# EAGLE schematic EMC03-Motion Control (EAGLE 7.4.0)

## Sheet 1 of 3: MCU
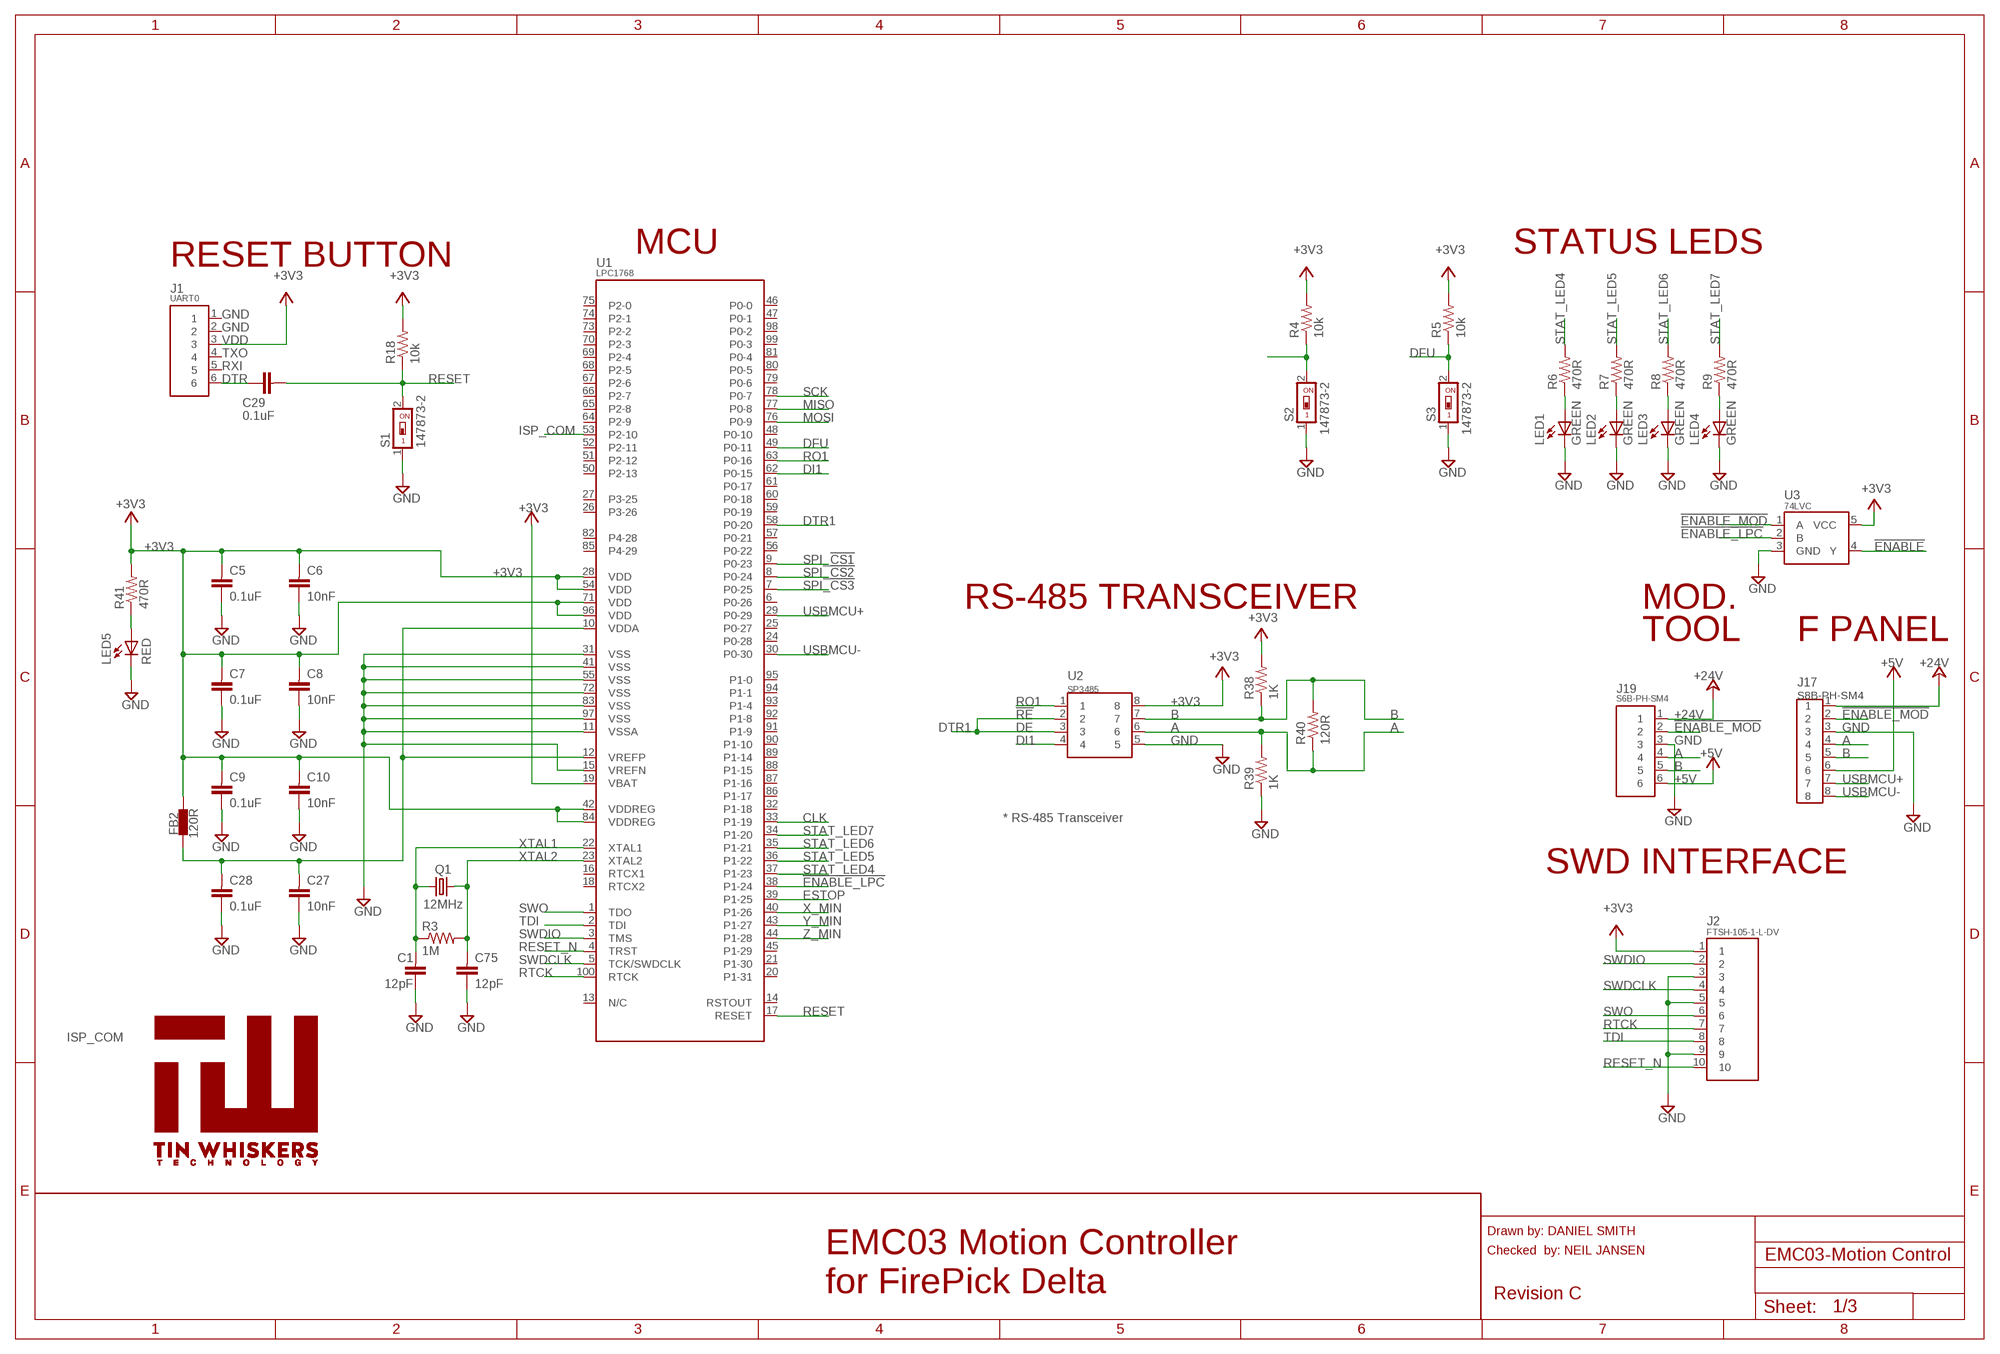
[diagram p0: schematic, sheet 1]

### Parts
C1  12pF  CPL-CAP-C0G-0603-12PF-50V  [C0603]
C5  0.1uF  CPL-CAP-X5R-0603-0.1UF-35V  [C0603]
C6  10nF  CPL-CAP-X7R-10NF-16V  [C0603]
C7  0.1uF  CPL-CAP-X5R-0603-0.1UF-35V  [C0603]
C8  10nF  CPL-CAP-X7R-10NF-16V  [C0603]
C9  0.1uF  CPL-CAP-X5R-0603-0.1UF-35V  [C0603]
C10  10nF  CPL-CAP-X7R-10NF-16V  [C0603]
C27  10nF  CPL-CAP-X7R-10NF-16V  [C0603]
C28  0.1uF  CPL-CAP-X5R-0603-0.1UF-35V  [C0603]
C29  0.1uF  CPL-CAP-X7R-0603-0.1UF-35V  [C0603]
C75  12pF  CPL-CAP-C0G-0603-12PF-50V  [C0603]
FB2  120R  CPL-IND-FER-120OHM-2A  [F0603]
J1  UART0  CPL-CON-HEADER-0.1IN-6P-M  [CON-HDR-6POS-MALE]
J2  FTSH-105-1-L-DV  CPL-CON-HEADER-0.05IN-10P-M  [FTSH-105-01-XXX-DV-K]
J17  S8B-PH-SM4  CPL-CON-JST-2.0MM-8P-M-RA  [CONN-JST-PH-2.0MM-8P-SMT-RA]
J19  S6B-PH-SM4  CPL-CON-JST-2.0MM-6P-M-RA  [CONN-JST-PH-2.0MM-6P-SMT-RA]
LED1  GREEN  CPL-LED-0603-GREEN  [LED0603]
LED2  GREEN  CPL-LED-0603-GREEN  [LED0603]
LED3  GREEN  CPL-LED-0603-GREEN  [LED0603]
LED4  GREEN  CPL-LED-0603-GREEN  [LED0603]
LED5  RED  CPL-LED-0603-RED  [LED0603]
Q1  12MHz  CPL-OSC-CRY-12MHZ-18PF  [HC-49/U-S]
R3  1M  CPL-RES-0603-1M-0.1W  [R0603]
R4  10k  CPL-RES-0603-10K-0.1W  [R0603]
R5  10k  CPL-RES-0603-10K-0.1W  [R0603]
R6  470R  CPL-RES-0603-470R-0.1W  [R0603]
R7  470R  CPL-RES-0603-470R-0.1W  [R0603]
R8  470R  CPL-RES-0603-470R-0.1W  [R0603]
R9  470R  CPL-RES-0603-470R-0.1W  [R0603]
R18  10k  CPL-RES-0603-10K-0.1W  [R0603]
R38  1K  CPL-RES-0603-1K-0.1W  [R0603]
R39  1K  CPL-RES-0603-1K-0.1W  [R0603]
R40  120R  CPL-RES-0603-120-0.1W  [R0603]
R41  470R  CPL-RES-0603-470R-0.1W  [R0603]
S1  147873-2  CPL-SW-MOM-147873-2  [147873-2]
S2  147873-2  CPL-SW-MOM-147873-2  [147873-2]
S3  147873-2  CPL-SW-MOM-147873-2  [147873-2]
U1  LPC1768  LPC1768LQFP-100  [100-LQFP]
U2  SP3485  [SOICN-8]
U3  74LVC  CPL-IC-LOGIC-OR-1CH-74LVC  [SOT-23-5]
U$1  TIN-WHISKERSSMALL  [TIN-WHISKERS-SMALL]

### Nets
!ENABLE: U3.4(Y) ; also sheet 2,3
!ENABLE_LPC: U1.38(P1-24) U3.2(B)
!ENABLE_MOD: J17.2 J19.2 U3.1(A)
+3V3: C5.2 C6.2 C7.2 C8.2 C9.2 C10.2 FB2.2 J1.3 J2.1 R4.2 R5.2 R18.2 R38.2 R41.2 U1.19(VBAT) U1.28(VDD) U1.42(VDDREG) U1.54(VDD) U1.71(VDD) U1.84(VDDREG) U1.96(VDD) U2.8 U3.5(VCC) ; also sheet 2
+5V [power]: J17.6 J19.6 ; also sheet 2
+24V: J17.1 J19.1 ; also sheet 2,3
A: J17.4 J19.4 R39.2 R40.1 U2.6
B: J17.5 J19.5 R38.1 R40.2 U2.7
CLK: U1.33(P1-19) ; also sheet 2,3
DFU: R5.1 S3.2 U1.49(P0-11)
DI1: U1.62(P0-15) U2.4
DPWR: C27.2 C28.2 FB2.1 U1.10(VDDA) U1.12(VREFP)
DTR: C29.1 J1.6
DTR1: U1.58(P0-20) U2.2 U2.3
ESTOP: U1.39(P1-25)
GND [power]: C1.1 C5.1 C6.1 C7.1 C8.1 C9.1 C10.1 C27.1 C28.1 C75.1 J2.3 J2.5 J2.9 J17.3 J19.3 LED1.C LED2.C LED3.C LED4.C LED5.C R39.1 S1.1 S2.1 S3.1 U1.11(VSSA) U1.15(VREFN) U1.31(VSS) U1.41(VSS) U1.55(VSS) U1.72(VSS) U1.83(VSS) U1.97(VSS) U2.5 U3.3(GND) ; also sheet 2,3
ISP_COM: R4.1 S2.2 U1.53(P2-10)
MISO: U1.77(P0-8) ; also sheet 2,3
MOSI: U1.76(P0-9) ; also sheet 2,3
N$9: LED5.A R41.1
N$20: LED1.A R6.1
N$24: LED2.A R7.1
N$25: LED4.A R9.1
N$26: LED3.A R8.1
RESET: C29.2 R18.1 S1.2 U1.17(RESET)
RESET_N: J2.10 U1.4(TRST)
RO1: U1.63(P0-16) U2.1
RTCK: J2.7 U1.100(RTCK)
SCK: U1.78(P0-7) ; also sheet 2,3
SPI_!CS1: U1.9(P0-23) ; also sheet 2
SPI_!CS2: U1.8(P0-24) ; also sheet 3
SPI_!CS3: U1.7(P0-25) ; also sheet 3
STAT_LED4: R6.2 U1.37(P1-23)
STAT_LED5: R7.2 U1.36(P1-22)
STAT_LED6: R8.2 U1.35(P1-21)
STAT_LED7: R9.2 U1.34(P1-20)
SWDCLK: J2.4 U1.5(TCK/SWDCLK)
SWDIO: J2.2 U1.3(TMS)
SWO: J2.6 U1.1(TDO)
TDI: J2.8 U1.2(TDI)
USBMCU+: J17.7 U1.29(P0-29)
USBMCU-: J17.8 U1.30(P0-30)
X_MIN: U1.40(P1-26) ; also sheet 2
XTAL1: C1.2 Q1.1 R3.1 U1.22(XTAL1)
XTAL2: C75.2 Q1.2 R3.2 U1.23(XTAL2)
Y_MIN: U1.43(P1-27) ; also sheet 2
Z_MIN: U1.44(P1-28) ; also sheet 2
Unconnected: J1.1 J1.2 J1.4 J1.5 U1.6(P0-26) U1.13(N/C) U1.14(RSTOUT) U1.16(RTCX1) U1.18(RTCX2) U1.20(P1-31) U1.21(P1-30) U1.24(P0-28) U1.25(P0-27) U1.26(P3-26) U1.27(P3-25) U1.32(P1-18) U1.45(P1-29) U1.46(P0-0) U1.47(P0-1) U1.48(P0-10) U1.50(P2-13) U1.51(P2-12) U1.52(P2-11) U1.56(P0-22) U1.57(P0-21) U1.59(P0-19) U1.60(P0-18) U1.61(P0-17) U1.64(P2-9) U1.65(P2-8) U1.66(P2-7) U1.67(P2-6) U1.68(P2-5) U1.69(P2-4) U1.70(P2-3) U1.73(P2-2) U1.74(P2-1) U1.75(P2-0) U1.79(P0-6) U1.80(P0-5) U1.81(P0-4) U1.82(P4-28) U1.85(P4-29) U1.86(P1-17) U1.87(P1-16) U1.88(P1-15) U1.89(P1-14) U1.90(P1-10) U1.91(P1-9) U1.92(P1-8) U1.93(P1-4) U1.94(P1-1) U1.95(P1-0) U1.98(P0-2) U1.99(P0-3)

### Notes on the sheet
- MCU | STATUS LEDS
- RESET BUTTON
- GND
- GND
- VDD
- TXO
- RXI
- RS-485 TRANSCEIVER | MOD.
- TOOL | F PANEL
- !RE
- DE
- * RS-485 Transceiver
- SWD INTERFACE
- Drawn by: DANIEL SMITH
- Checked  by: NEIL JANSEN
- EMC03 Motion Controller
  for FirePick Delta
- Revision C

## Sheet 2 of 3: Pwr/Endstop
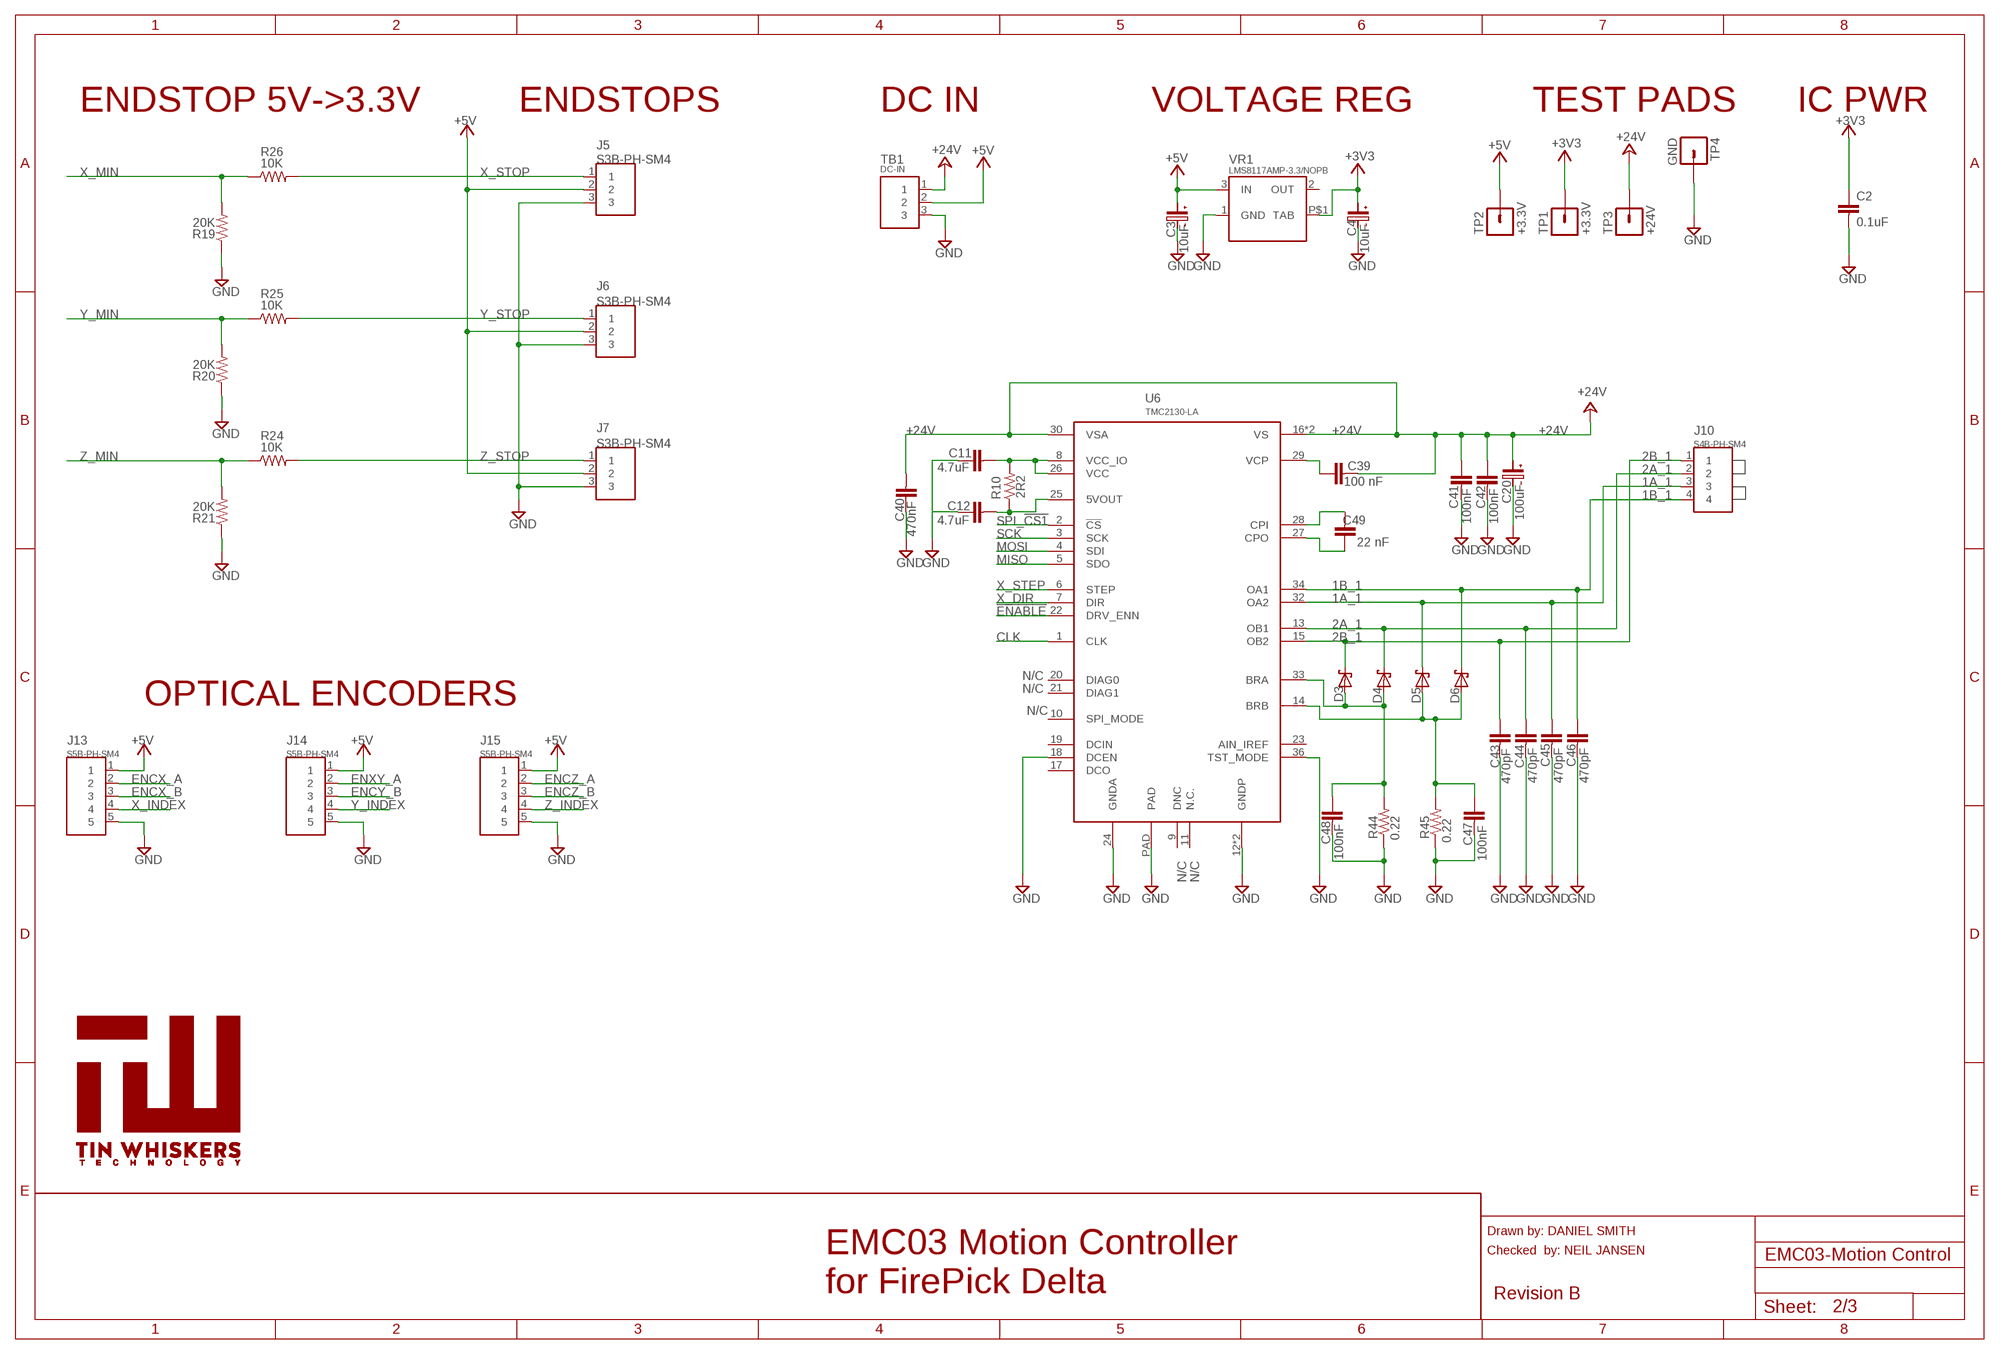
[diagram p1: schematic, sheet 2]

### Parts
C2  0.1uF  CPL-CAP-X7R-0603-100NF-50V  [C0603]
C3  10uF  CPL-CAP-ALU-6.4MM-10UF-10V  [C-SMD-6.3MM]
C4  10uF  CPL-CAP-ALU-6.4MM-10UF-10V  [C-SMD-6.3MM]
C11  4.7uF  CPL-CAP-X5R-0603-4.7UF-10V  [C0603]
C12  4.7uF  CPL-CAP-X5R-0603-4.7UF-10V  [C0603]
C20  100uF  CPL-CAP-ALU-SMD-100UF-50V  [C-SMD-6.3MM]
C39  100 nF  CPL-CAP-X7R-0603-100NF-100V  [C0603]
C40  470nF  CPL-CAP-X7R-0603-0.47UF-35V  [C0603]
C41  100nF  CPL-CAP-X7R-0603-100NF-100V  [C0603]
C42  100nF  CPL-CAP-X7R-0603-100NF-100V  [C0603]
C43  470pF  CPL-CAP-X7R-0603-470PF-100V  [C0603]
C44  470pF  CPL-CAP-X7R-0603-470PF-100V  [C0603]
C45  470pF  CPL-CAP-X7R-0603-470PF-100V  [C0603]
C46  470pF  CPL-CAP-X7R-0603-470PF-100V  [C0603]
C47  100nF  CPL-CAP-X7R-0603-100NF-50V  [C0603]
C48  100nF  CPL-CAP-X7R-0603-100NF-50V  [C0603]
C49  22 nF  CPL-CAP-X7R-0603-22NF-50V"  [C0603]
D3  MSS1P6  CPL-DIO-MSS1P6-MICROSMP  [MICRO-SMP]
D4  MSS1P6  CPL-DIO-MSS1P6-MICROSMP  [MICRO-SMP]
D5  MSS1P6  CPL-DIO-MSS1P6-MICROSMP  [MICRO-SMP]
D6  MSS1P6  CPL-DIO-MSS1P6-MICROSMP  [MICRO-SMP]
J5  S3B-PH-SM4  CPL-CON-JST-2.0MM-3P-M-RA  [CONN-JST-PH-2.0MM-3P-SMT-RA]
J6  S3B-PH-SM4  CPL-CON-JST-2.0MM-3P-M-RA  [CONN-JST-PH-2.0MM-3P-SMT-RA]
J7  S3B-PH-SM4  CPL-CON-JST-2.0MM-3P-M-RA  [CONN-JST-PH-2.0MM-3P-SMT-RA]
J10  S4B-PH-SM4  CPL-CON-JST-2.0MM-4P-M-RA  [CONN-JST-PH-2.0MM-4P-SMT-RA]
J13  S5B-PH-SM4  CPL-CON-JST-2.0MM-5P-M-RA  [CONN-JST-PH-2.0MM-5P-SMT-RA]
J14  S5B-PH-SM4  CPL-CON-JST-2.0MM-5P-M-RA  [CONN-JST-PH-2.0MM-5P-SMT-RA]
J15  S5B-PH-SM4  CPL-CON-JST-2.0MM-5P-M-RA  [CONN-JST-PH-2.0MM-5P-SMT-RA]
R10  2R2  CPL-RES-0603-2.2-0.1W  [R0603]
R19  20K  CPL-RES-0603-20K-0.1W  [R0603]
R20  20K  CPL-RES-0603-20K-0.1W  [R0603]
R21  20K  CPL-RES-0603-20K-0.1W  [R0603]
R24  10K  CPL-RES-0603-10K-0.1W  [R0603]
R25  10K  CPL-RES-0603-10K-0.1W  [R0603]
R26  10K  CPL-RES-0603-10K-0.1W  [R0603]
R44  0.22  CPL-RES-1206-0.22-0.5W  [R1206]
R45  0.22  CPL-RES-1206-0.22-0.5W  [R1206]
TB1  DC-IN  CPL-TBLK-SCR-3CKT-5.0MM-OST  [TBLOCK-3-5MM-OSTTH030160]
TP1  +3.3V  TPAD  [TESTPAD]
TP2  +3.3V  TPAD  [TESTPAD]
TP3  +24V  TPAD  [TESTPAD]
TP4  GND  TPAD  [TESTPAD]
U6  TMC2130-LA  CPL-MDR-2PHSTEPPER  [36-QFN(5X6)]
U$2  TIN-WHISKERSSMALL  [TIN-WHISKERS-SMALL]
VR1  LMS8117AMP-3.3/NOPB  CPL-REG-LIN-3.3V-1A  [SOT-223]

### Nets
1A_1: C45.1 D5.NEG(C) J10.3 U6.32(OA2)
1B_1: C46.1 D6.NEG(C) J10.4 U6.34(OA1)
2A_1: C44.1 D4.NEG(C) J10.2 U6.13(OB1)
2B_1: C43.1 D3.NEG(C) J10.1 U6.15(OB2)
!ENABLE: U6.22(DRV_ENN) ; also sheet 1,3
+3V3: C2.1 C4.POS TP1.PAD VR1.P$1(TAB) ; also sheet 1
+5V [power]: C3.POS J5.2 J6.2 J7.2 J13.1 J14.1 J15.1 TB1.2 TP2.PAD VR1.3(IN) ; also sheet 1
+24V: C20.POS C39.2 C40.2 C41.1 C42.1 TB1.1 TP3.PAD U6.16(VS) U6.30(VSA) U6.31(VS) ; also sheet 1,3
BRA: C48.1 D3.POS(A) D4.POS(A) R44.2 U6.33(BRA)
BRB: C47.1 D5.POS(A) D6.POS(A) R45.2 U6.14(BRB)
CLK: U6.1(CLK) ; also sheet 1,3
CPI: C49.2 U6.28(CPI)
CPO: C49.1 U6.27(CPO)
ENCX_A: J13.2
ENCX_B: J13.3
ENCY_B: J14.3
ENCZ_A: J15.2
ENCZ_B: J15.3
ENXY_A: J14.2
GND [power]: C2.2 C3.NEG C4.NEG C11.1 C12.1 C20.NEG C40.1 C41.2 C42.2 C43.2 C44.2 C45.2 C46.2 C47.2 C48.2 J5.3 J6.3 J7.3 J13.5 J14.5 J15.5 R19.1 R20.1 R21.1 R44.1 R45.1 TB1.3 TP4.PAD U6.12(GNDP) U6.18(DCEN) U6.24(GNDA) U6.35(GNDP) U6.36(TST_MODE) U6.PAD VR1.1(GND) ; also sheet 1,3
MISO: U6.5(SDO) ; also sheet 1,3
MOSI: U6.4(SDI) ; also sheet 1,3
N$1: C11.2 R10.2 U6.8(VCC_IO) U6.26(VCC)
N$2 [power]: C12.2 R10.1 U6.25(5VOUT)
SCK: U6.3(SCK) ; also sheet 1,3
SPI_!CS1: U6.2(!CS) ; also sheet 1
VCP: C39.1 U6.29(VCP)
X_DIR: U6.7(DIR)
X_INDEX: J13.4
X_MIN: R19.2 R26.1 ; also sheet 1
X_STEP: U6.6(STEP)
X_STOP: J5.1 R26.2
Y_INDEX: J14.4
Y_MIN: R20.2 R25.1 ; also sheet 1
Y_STOP: J6.1 R25.2
Z_INDEX: J15.4
Z_MIN: R21.2 R24.1 ; also sheet 1
Z_STOP: J7.1 R24.2
Unconnected: U6.9(DNC) U6.10(SPI_MODE) U6.11(N.C.) U6.17(DCO) U6.19(DCIN) U6.20(DIAG0) U6.21(DIAG1) U6.23(AIN_IREF) VR1.2(OUT)

### Notes on the sheet
- ENDSTOP 5V->3.3V | ENDSTOPS | DC IN | VOLTAGE REG | TEST PADS | IC PWR
- N/C
- N/C
- OPTICAL ENCODERS | N/C
- N/C | N/C
- Drawn by: DANIEL SMITH
- Checked  by: NEIL JANSEN
- EMC03 Motion Controller
  for FirePick Delta
- Revision B

## Sheet 3 of 3: Mot/E-Stop
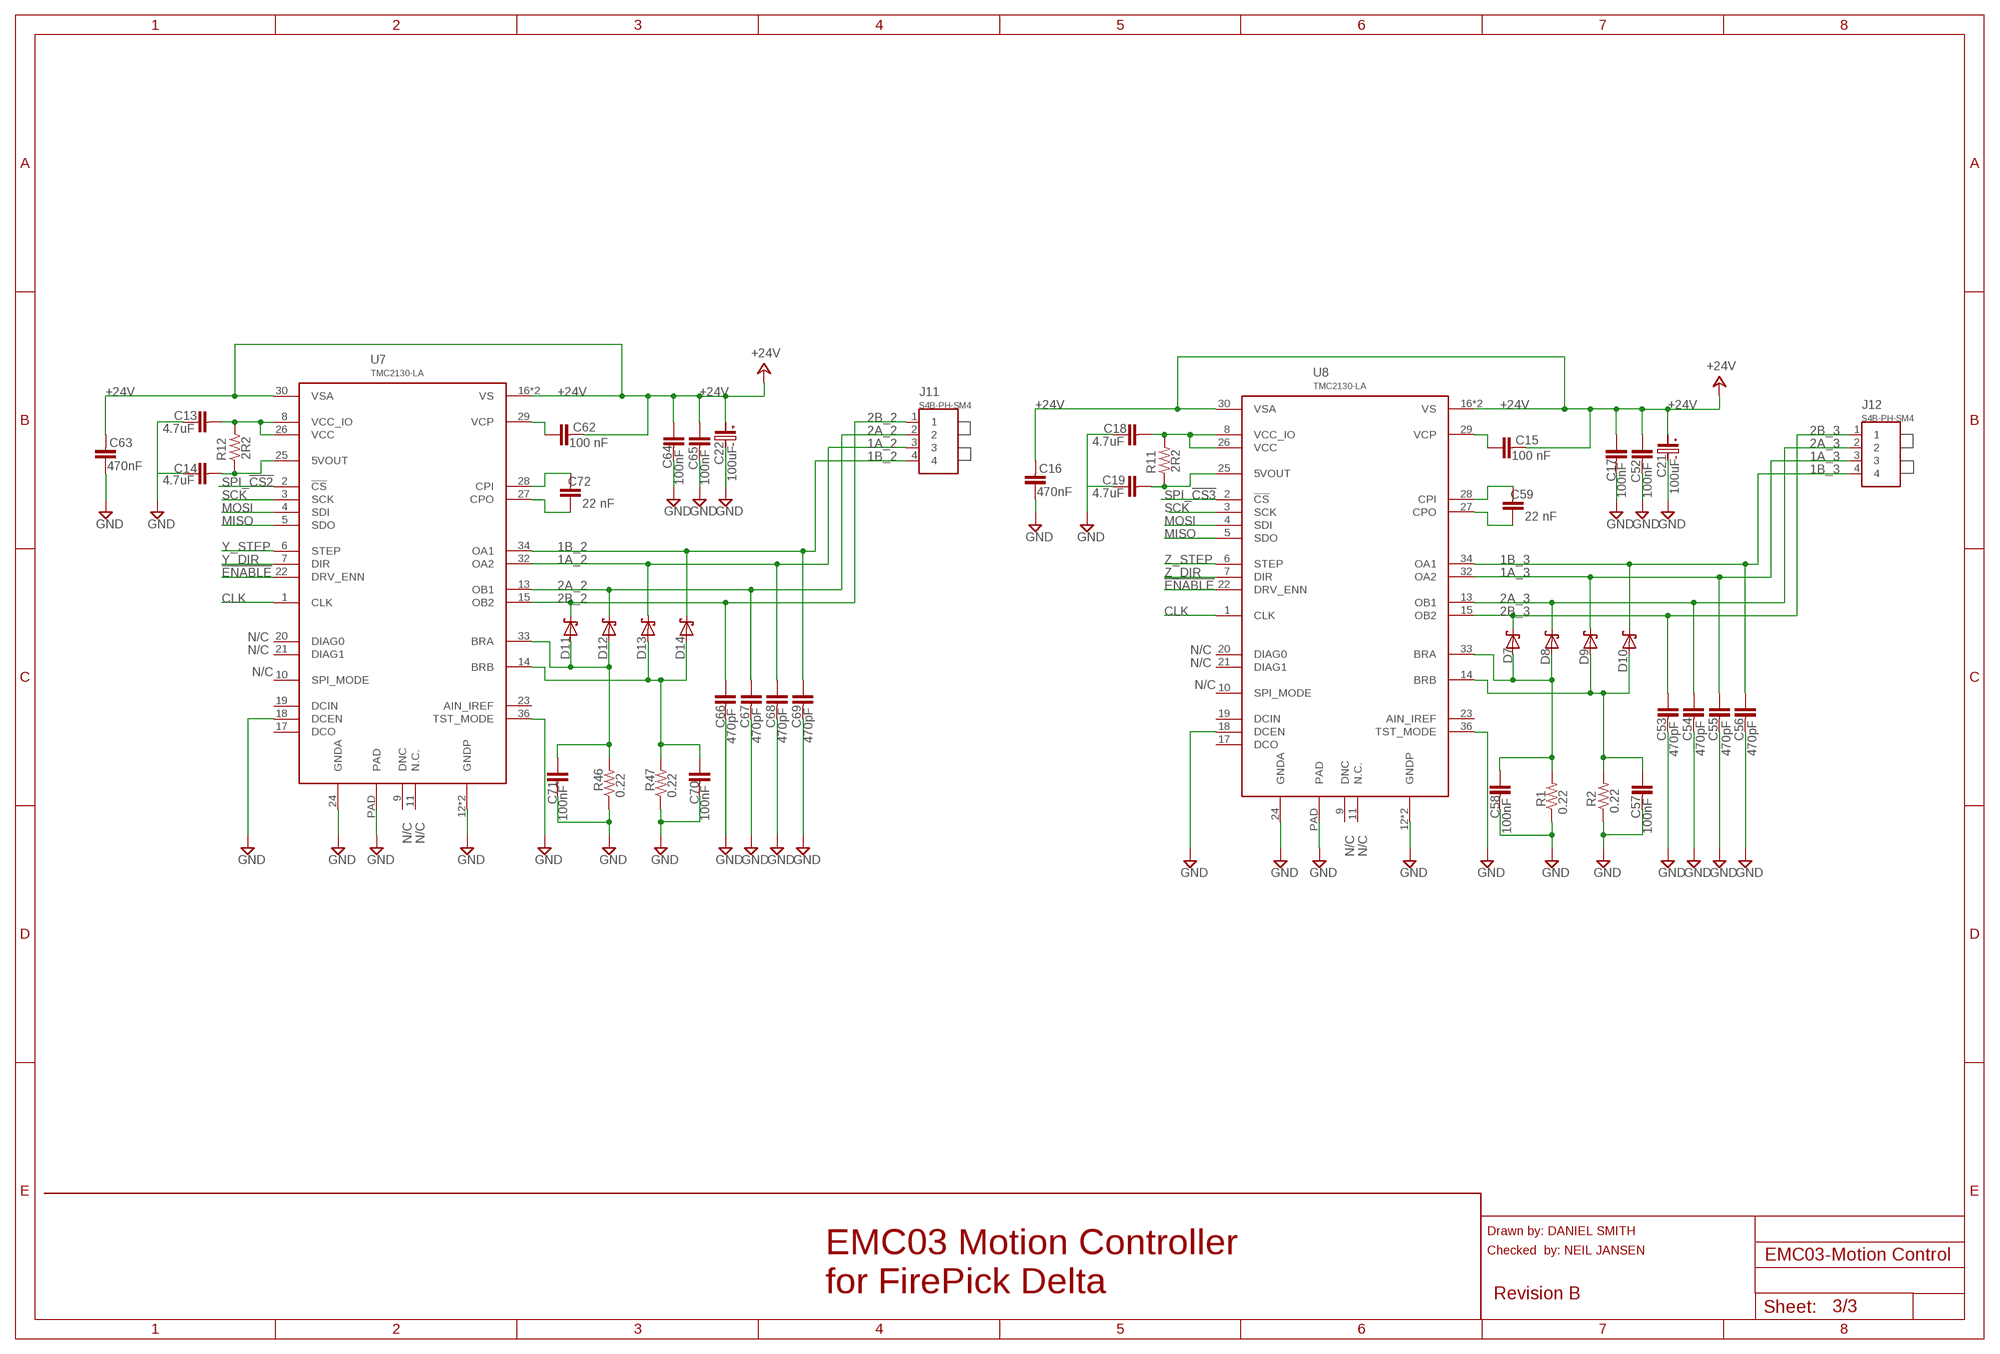
[diagram p2: schematic, sheet 3]

### Parts
C13  4.7uF  CPL-CAP-X5R-0603-4.7UF-10V  [C0603]
C14  4.7uF  CPL-CAP-X5R-0603-4.7UF-10V  [C0603]
C15  100 nF  CPL-CAP-X7R-0603-100NF-100V  [C0603]
C16  470nF  CPL-CAP-X7R-0603-0.47UF-35V  [C0603]
C17  100nF  CPL-CAP-X7R-0603-100NF-100V  [C0603]
C18  4.7uF  CPL-CAP-X5R-0603-4.7UF-10V  [C0603]
C19  4.7uF  CPL-CAP-X5R-0603-4.7UF-10V  [C0603]
C21  100uF  CPL-CAP-ALU-SMD-100UF-50V  [C-SMD-6.3MM]
C22  100uF  CPL-CAP-ALU-SMD-100UF-50V  [C-SMD-6.3MM]
C52  100nF  CPL-CAP-X7R-0603-100NF-100V  [C0603]
C53  470pF  CPL-CAP-X7R-0603-470PF-100V  [C0603]
C54  470pF  CPL-CAP-X7R-0603-470PF-100V  [C0603]
C55  470pF  CPL-CAP-X7R-0603-470PF-100V  [C0603]
C56  470pF  CPL-CAP-X7R-0603-470PF-100V  [C0603]
C57  100nF  CPL-CAP-X7R-0603-100NF-50V  [C0603]
C58  100nF  CPL-CAP-X7R-0603-100NF-50V  [C0603]
C59  22 nF  CPL-CAP-X7R-0603-22NF-50V"  [C0603]
C62  100 nF  CPL-CAP-X7R-0603-100NF-100V  [C0603]
C63  470nF  CPL-CAP-X7R-0603-0.47UF-35V  [C0603]
C64  100nF  CPL-CAP-X7R-0603-100NF-100V  [C0603]
C65  100nF  CPL-CAP-X7R-0603-100NF-100V  [C0603]
C66  470pF  CPL-CAP-X7R-0603-470PF-100V  [C0603]
C67  470pF  CPL-CAP-X7R-0603-470PF-100V  [C0603]
C68  470pF  CPL-CAP-X7R-0603-470PF-100V  [C0603]
C69  470pF  CPL-CAP-X7R-0603-470PF-100V  [C0603]
C70  100nF  CPL-CAP-X7R-0603-100NF-50V  [C0603]
C71  100nF  CPL-CAP-X7R-0603-100NF-50V  [C0603]
C72  22 nF  CPL-CAP-X7R-0603-22NF-50V"  [C0603]
D7  MSS1P6  CPL-DIO-MSS1P6-MICROSMP  [MICRO-SMP]
D8  MSS1P6  CPL-DIO-MSS1P6-MICROSMP  [MICRO-SMP]
D9  MSS1P6  CPL-DIO-MSS1P6-MICROSMP  [MICRO-SMP]
D10  MSS1P6  CPL-DIO-MSS1P6-MICROSMP  [MICRO-SMP]
D11  MSS1P6  CPL-DIO-MSS1P6-MICROSMP  [MICRO-SMP]
D12  MSS1P6  CPL-DIO-MSS1P6-MICROSMP  [MICRO-SMP]
D13  MSS1P6  CPL-DIO-MSS1P6-MICROSMP  [MICRO-SMP]
D14  MSS1P6  CPL-DIO-MSS1P6-MICROSMP  [MICRO-SMP]
J11  S4B-PH-SM4  CPL-CON-JST-2.0MM-4P-M-RA  [CONN-JST-PH-2.0MM-4P-SMT-RA]
J12  S4B-PH-SM4  CPL-CON-JST-2.0MM-4P-M-RA  [CONN-JST-PH-2.0MM-4P-SMT-RA]
R1  0.22  CPL-RES-1206-0.22-0.5W  [R1206]
R2  0.22  CPL-RES-1206-0.22-0.5W  [R1206]
R11  2R2  CPL-RES-0603-2.2-0.1W  [R0603]
R12  2R2  CPL-RES-0603-2.2-0.1W  [R0603]
R46  0.22  CPL-RES-1206-0.22-0.5W  [R1206]
R47  0.22  CPL-RES-1206-0.22-0.5W  [R1206]
U7  TMC2130-LA  CPL-MDR-2PHSTEPPER  [36-QFN(5X6)]
U8  TMC2130-LA  CPL-MDR-2PHSTEPPER  [36-QFN(5X6)]

### Nets
1A_2: C68.1 D13.NEG(C) J11.3 U7.32(OA2)
1A_3: C55.1 D9.NEG(C) J12.3 U8.32(OA2)
1B_2: C69.1 D14.NEG(C) J11.4 U7.34(OA1)
1B_3: C56.1 D10.NEG(C) J12.4 U8.34(OA1)
2A_2: C67.1 D12.NEG(C) J11.2 U7.13(OB1)
2A_3: C54.1 D8.NEG(C) J12.2 U8.13(OB1)
2B_2: C66.1 D11.NEG(C) J11.1 U7.15(OB2)
2B_3: C53.1 D7.NEG(C) J12.1 U8.15(OB2)
!ENABLE: U7.22(DRV_ENN) U8.22(DRV_ENN) ; also sheet 1,2
+24V: C15.2 C16.2 C17.1 C21.POS C22.POS C52.1 C62.2 C63.2 C64.1 C65.1 U7.16(VS) U7.30(VSA) U7.31(VS) U8.16(VS) U8.30(VSA) U8.31(VS) ; also sheet 1,2
BRA2: C71.1 D11.POS(A) D12.POS(A) R46.2 U7.33(BRA)
BRA3: C58.1 D7.POS(A) D8.POS(A) R1.2 U8.33(BRA)
BRB2: C70.1 D13.POS(A) D14.POS(A) R47.2 U7.14(BRB)
BRB3: C57.1 D9.POS(A) D10.POS(A) R2.2 U8.14(BRB)
CLK: U7.1(CLK) U8.1(CLK) ; also sheet 1,2
CPI1: C59.2 U8.28(CPI)
CPI2: C72.2 U7.28(CPI)
CPO1: C59.1 U8.27(CPO)
CPO2: C72.1 U7.27(CPO)
GND [power]: C13.1 C14.1 C16.1 C17.2 C18.1 C19.1 C21.NEG C22.NEG C52.2 C53.2 C54.2 C55.2 C56.2 C57.2 C58.2 C63.1 C64.2 C65.2 C66.2 C67.2 C68.2 C69.2 C70.2 C71.2 R1.1 R2.1 R46.1 R47.1 U7.12(GNDP) U7.18(DCEN) U7.24(GNDA) U7.35(GNDP) U7.36(TST_MODE) U7.PAD U8.12(GNDP) U8.18(DCEN) U8.24(GNDA) U8.35(GNDP) U8.36(TST_MODE) U8.PAD ; also sheet 1,2
MISO: U7.5(SDO) U8.5(SDO) ; also sheet 1,2
MOSI: U7.4(SDI) U8.4(SDI) ; also sheet 1,2
N$3 [power]: C19.2 R11.1 U8.25(5VOUT)
N$4: C18.2 R11.2 U8.8(VCC_IO) U8.26(VCC)
N$5 [power]: C14.2 R12.1 U7.25(5VOUT)
N$6: C13.2 R12.2 U7.8(VCC_IO) U7.26(VCC)
SCK: U7.3(SCK) U8.3(SCK) ; also sheet 1,2
SPI_!CS2: U7.2(!CS) ; also sheet 1
SPI_!CS3: U8.2(!CS) ; also sheet 1
VCP1: C15.1 U8.29(VCP)
VCP2: C62.1 U7.29(VCP)
Y_DIR: U7.7(DIR)
Y_STEP: U7.6(STEP)
Z_DIR: U8.7(DIR)
Z_STEP: U8.6(STEP)
Unconnected: U7.9(DNC) U7.10(SPI_MODE) U7.11(N.C.) U7.17(DCO) U7.19(DCIN) U7.20(DIAG0) U7.21(DIAG1) U7.23(AIN_IREF) U8.9(DNC) U8.10(SPI_MODE) U8.11(N.C.) U8.17(DCO) U8.19(DCIN) U8.20(DIAG0) U8.21(DIAG1) U8.23(AIN_IREF)

### Notes on the sheet
- N/C
- N/C | N/C
- N/C | N/C
- N/C
- N/C | N/C
- N/C | N/C
- Drawn by: DANIEL SMITH
- Checked  by: NEIL JANSEN
- EMC03 Motion Controller
  for FirePick Delta
- Revision B

## Library data of the parts
C1 C75 = TinWhiskers:CPL-CAP-C0G-0603-12PF-50V: Capacitor: 12pF, 50V, 5%; Package: 0603; Datasheet: http://download.siliconexpert.com/pdfs/2011/4/6/10/1/57/701/samelm_/manual/cl10c120jb8nnnc.pdf; PARTNO: GRM1885C1H120FA01J
C2 C47 C48 C57 C58 C70 C71 = TinWhiskers:CPL-CAP-X7R-0603-100NF-50V: Capacitor: 100nF, 50V, 10%; Package: 0603; PARTNO: UMK107B7104KA-T
C3 C4 = TinWhiskers:CPL-CAP-ALU-6.4MM-10UF-10V: Capacitor: Al-Electrolytic, 10uF, 10V 20$; Package: 6.3MM SMT (Can); Datasheet: http://www.ti.com/lit/ds/symlink/lms8117a.pdf; PARTNO: EMVH350ADA100MF60G
C5 C7 C9 C28 = TinWhiskers:CPL-CAP-X5R-0603-0.1UF-35V: Capacitor: 0.1uF, 35V, 10%, X5R; Package: 0603; Datasheet: http://www.yuden.co.jp/productdata/catalog/en/mlcc01_hq_e.pdf; PARTNO: GMK107BJ104KAHT
C6 C8 C10 C27 = TinWhiskers:CPL-CAP-X7R-10NF-16V: Capacitor: 10nF(0.01uF), 16V, 5%; Package: 0603; Datasheet: http://www.mouser.com/ds/2/396/mlcc_all_e-541559.pdf; PARTNO: GRM188R71H103KA01D
C11-C14 C18 C19 = TinWhiskers:CPL-CAP-X5R-0603-4.7UF-10V: Capacitor: 4.7uF, 10V, 10% Package: 0603; Datasheet: http://www.yuden.co.jp/productdata/catalog/en/mlcc_all_e.pdf; PARTNO: GRM188C81E475KE11D
C15 C17 C39 C41 C42 C52 C62 C64 C65 = TinWhiskers:CPL-CAP-X7R-0603-100NF-100V: Capacitor: 100nF, 100V, 10%; Package: 0603; Datasheet:; PARTNO: UMK107B7104KA-T
C16 C40 C63 = TinWhiskers:CPL-CAP-X7R-0603-0.47UF-35V; PARTNO: UMK107B7474KA-TR
C20-C22 = TinWhiskers:CPL-CAP-ALU-SMD-100UF-50V: Capacitor: Al-Electrolytic, 100uF, 20%, 50V, 2000hrs@105C; Package: 6.3MM Diameter (Can); Datasheet: http://industrial.panasonic.com/lecs/www-data/pdf/ABA0000/ABA0000CE135.pdf; PARTNO: EEE-FTH101XAP
C29 = TinWhiskers:CPL-CAP-X7R-0603-0.1UF-35V: Capacitor: 0.1uF, 35V, 10%, X7R; Package: 0603; Datasheet: http://www.yuden.co.jp/productdata/catalog/en/mlcc01_hq_e.pdf; PARTNO: GMK107BJ104KAHT
C43-C46 C53-C56 C66-C69 = TinWhiskers:CPL-CAP-X7R-0603-470PF-100V: Capacitor: 470pF, 100V, 5%; Package: 0603 Datasheet: http://www.mouser.com/ds/2/427/vjw1bcbascomseries-223529.pdf; PARTNO: GRM188R72A471KA01D
C49 C59 C72 = TinWhiskers:CPL-CAP-X7R-0603-22NF-50V: Capacitor Specs: 22nF, 50V, 10%, Package: 0603; PARTNO: GRM188R71H223KA01D
D3-D14 = TinWhiskers:CPL-DIO-MSS1P6-MICROSMP: Diode: Rectifier, 1A, 60V; Package: Micro-SMP; Datasheet: http://www.vishay.com/docs/89018/mss1p6.pdf; PARTNO: MSS1P6
FB2 = TinWhiskers:CPL-IND-FER-120OHM-2A: Ferrite Bead: 120 Ohm, 2A, 25%; Package: 0603; Datasheet: http://www.mouser.com/ds/2/281/c31e-522703.pdf P/N: BLM18PG121SN1D; PARTNO: BLM18AG121SN1D
J1 = TinWhiskers:CPL-CON-HEADER-0.1IN-6P-M: Connector: Header, 0.1"-Pitch, 6-Pos, Pins (Male); PARTNO: 67996-206HLF
J2 = TinWhiskers:CPL-CON-HEADER-0.05IN-10P-M; PARTNO: FTSH-105-01-L-DV
J5-J7 = TinWhiskers:CPL-CON-JST-2.0MM-3P-M-RA: Connector: 2.0mm Pitch, 3-POS, Pin, Shrouded; Package: PH-Series (SMT, R/A); Datasheet: http://www.jst-mfg.com/product/pdf/eng/ePH.pdf; PARTNO: S3B-PH-SM4-TB(LF)(SN)
J10-J12 = TinWhiskers:CPL-CON-JST-2.0MM-4P-M-RA: Connector: 2.0mm Pitch, 4-POS, Pin, Shrouded; Package: PH-Series (SMT, R/A); Datasheet: http://www.jst-mfg.com/product/pdf/eng/ePH.pdf; PARTNO: S4B-PH-SM4-TB(LF)(SN)
J13-J15 = TinWhiskers:CPL-CON-JST-2.0MM-5P-M-RA: Connector: 2.0mm Pitch, 5-POS, Pin, Shrouded; Package: PH-Series (SMT, R/A); Datasheet: http://www.jst-mfg.com/product/pdf/eng/ePH.pdf; PARTNO: S5B-PH-SM4-TB(LF)(SN)
J17 = TinWhiskers:CPL-CON-JST-2.0MM-8P-M-RA: Connector: 2.0mm Pitch, 8-POS, Pin, Shrouded; Package: HR-Series (SMT, R/A); Datasheet: http://www.jst-mfg.com/product/pdf/eng/ePH.pdf; PARTNO: S8B-PH-SM4-TB(LF)(SN)
J19 = TinWhiskers:CPL-CON-JST-2.0MM-6P-M-RA: Connector: 2.0mm Pitch, 6-POS, Pins, Shrouded; Package: PH-Series (SMT, R/A); Datasheet: http://www.jst-mfg.com/product/pdf/eng/ePH.pdf; PARTNO: S6B-PH-SM4-TB(LF)(SN)
LED1-LED4 = TinWhiskers:CPL-LED-0603-GREEN: LED: Green; Package: 0603; PARTNO: SML-D12M8WT86
LED5 = TinWhiskers:CPL-LED-0603-RED: LED: Red; Package: 0603; PARTNO: SML-D12U8WT86
Q1 = TinWhiskers:CPL-OSC-CRY-12MHZ-18PF: Resonating Crystal: 12.000 MHz, 18pF, 30ppm; Package: HS-49/US; Datasheet: http://cfm.citizen.co.jp/english/product/pdf/HCM49.pdf; PARTNO: HCM4912000000ABJT
R1 R2 R44-R47 = TinWhiskers:CPL-RES-1206-0.22-0.5W: Resistor: 0.22 Ohm, 0.5W, 1%, 100 ppm/C Package: 1206 Datasheet: http://www.mouser.com/ds/2/427/rcwe-244377.pdf; PARTNO: RL1206FR-7W0R22L
R3 = TinWhiskers:CPL-RES-0603-1M-0.1W: Resistor: 1MOhm, 0.1W, 5%; Package: 0603; Datasheet: http://www.samsungsem.com/global/support/library/product-catalog/__icsFiles/afieldfile/2015/01/12/CHIP_RESISTOR_150112_1.pdf; PARTNO: RC0603FR-071ML
R4 R5 R18 R24-R26 = TinWhiskers:CPL-RES-0603-10K-0.1W: Resistor: 10kOhm, 0.1W, 1%; Package: 0603; Datasheet: http://www.mouser.com/ds/2/315/AOA0000CE2-37512.pdf; PARTNO: RC0603FR-0710KL
R6-R9 R41 = TinWhiskers:CPL-RES-0603-470R-0.1W: Resistor: 470 Ohm, 0.1W, 1%; Package: 0603; Datasheet: http://industrial.panasonic.com/ww/products/resistors/chip-resistors/chip-resistors/thick-film-chip-resistors/ERJ3GEYJ471V; PARTNO: RC0603FR-07470RL
R10-R12 = TinWhiskers:CPL-RES-0603-2.2-0.1W: Resistor, 2.2 kOhm, 0.1W, 1% Package: 0603 Specs: http://www.mouser.com/ds/2/427/dcrcwe3-109170.pdf; PARTNO: RC0603FR-072R2L
R19-R21 = TinWhiskers:CPL-RES-0603-20K-0.1W: Resistor: 20 kOhms, 0.1W, 5%, X7R; Package: 0603;; PARTNO: RC0603FR-0720KL
R38 R39 = TinWhiskers:CPL-RES-0603-1K-0.1W: Resistor: 1 kOhm, 0.1W, 1%; Package: 0603; Datasheet: http://www.yageo.com/NewPortal/yageodocoutput?fileName=/pdf/R-Chip/PYu-RC_Group_51_RoHS_L_3.pdf; PARTNO: RC0603FR-071KL
R40 = TinWhiskers:CPL-RES-0603-120-0.1W: Resistor: 120 Ohm, 0.1W, 1%; Package: 0603 (SMT); Datasheet:; PARTNO: RC0805FR-07120RL
S1-S3 = TinWhiskers:CPL-SW-MOM-147873-2: Switch: Momentary, ON-OFF (TE: 147873-2); Package: SMT; Datasheet: http://www.te.com/usa-en/product-147873-2.html; PARTNO: 147873-2
TB1 = TinWhiskers:CPL-TBLK-SCR-3CKT-5.0MM-OST: Terminal Block: Screws, 3-Circuit, 300kV (OSTTH030160); Package: Thru-Hole, R/A, Green; Datasheet: http://www.on-shore.com/sites/default/files/manuals/ostthxx0160.pdf; PARTNO: OSTTH030160
TP1-TP4 = TinWhiskers:TPAD: Testpad (1mm x 1mm); DNP: T; PARTNO: N/A
U1 = TinWhiskers:LPC1768: Microprocessor: ARM Cortex-M3 Mfr: NXP Semiconductors; Package: LQFP-100; Datasheet: http://www.nxp.com/documents/data_sheet/LPC1769_68_67_66_65_64_63.pdf; PARTNO: LPC1768
U2 = TinWhiskers:SP3485: Transceiver: RS-485 Chip; Package: SOICN-8; Datasheet: http://www.exar.com/common/content/document.ashx?id=639; PARTNO: SP3485
U3 = TinWhiskers:CPL-IC-LOGIC-OR-1CH-74LVC: Logic Gate: OR, 1-Channel; Package: SOT23-5; Datasheet: http://www.ti.com/lit/ds/symlink/sn74lvc1g32.pdf; PARTNO: SN74LVC1G32DBVR
U6-U8 = TinWhiskers:CPL-MDR-2PHSTEPPER: Stepper Driver (Trinamic TMC2130-LA); PARTNO: TMC2130-LA
U$1 U$2 = !tin-whiskers-logo:TIN-WHISKERS; PARTNO: *
VR1 = TinWhiskers:CPL-REG-LIN-3.3V-1A: Voltage Regulator: 3.3V, 1A (TI: LMS8117AMP-3.3/NOPB); Package: TO223; Datasheet: http://www.ti.com/lit/ds/symlink/lms8117a.pdf; PARTNO: LMS8117AMP-3.3/NOPB

## Net classes
0 default: width 0.152 mm, drill 0.305 mm, clearance 0.152 mm